# EAGLE schematic Transimpedance_Amp_SchnitzerLab (EAGLE 6.4)
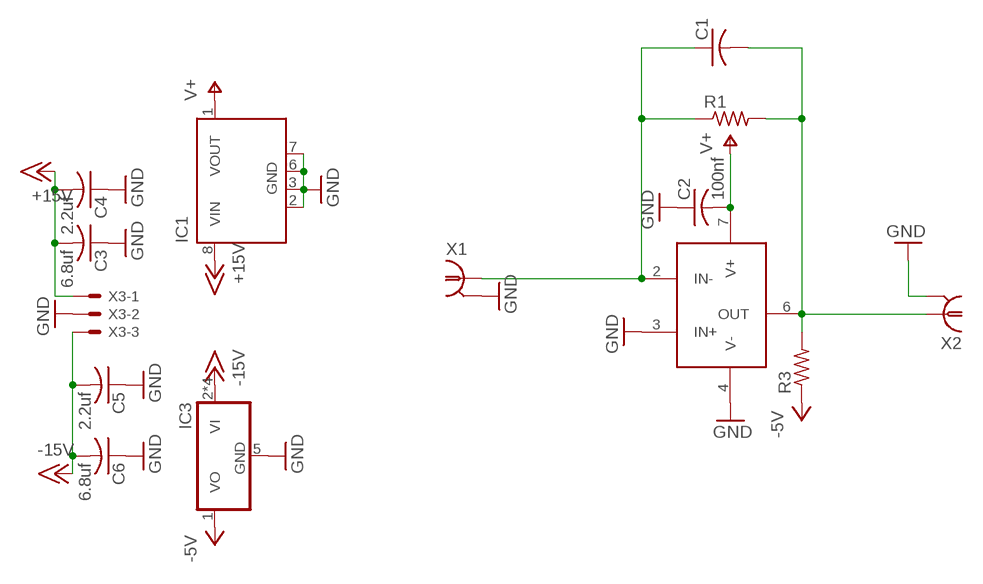
[diagram p0: schematic, sheet 1]

## Parts
C1  C-USC1206  [C1206]
C2  100nf  C-USC0504  [C0504]
C3  6.8uf  C-USC1206  [C1206]
C4  2.2uf  C-USC1206  [C1206]
C5  2.2uf  C-USC1206  [C1206]
C6  6.8uf  C-USC1206  [C1206]
IC1  78L05SMD  [SO08]
IC2  OPA380AIDG4  [SOIC8]
IC3  79LSMD  [SOIC8]
R1  R-US_M1206  [M1206]
R3  R-US_M1206  [M1206]
X1  1-227161-6  [AMP_227161]
X2  1-227161-6  [AMP_227161]
X3  22-23-2031  [22-23-2031]

## Nets
+15V: C3.2 C4.2 IC1.8(VIN) X3.1
-5V: IC3.1(VO) R3.1
-15V: C5.2 C6.2 IC3.2(VI) IC3.3(VI) IC3.6(VI) IC3.7(VI) X3.3
GND: C2.1 C3.1 C4.1 C5.1 C6.1 IC1.2(GND) IC1.6(GND) IC1.7(GND) IC2.3(IN+) IC2.4(V-) IC3.5(GND) X1.2 X2.2 X3.2
N$1: C1.1 IC2.2(IN-) R1.1 X1.1
N$2: C1.2 IC2.6(OUT) R1.2 R3.2 X2.1
V+: C2.2 IC1.1(VOUT) IC2.7(V+)
Unconnected: IC1.4(NC) IC1.5(NC)

## Power pins joined to a net without a drawn wire
GND: IC1.3(GND)

## Library data of the parts
C1-C6 = rcl:C-US: CAPACITOR, American symbol
IC1 = linear:78L*SMD: Positive VOLTAGE REGULATOR
IC2 = Custom:OPA380AIDG4
IC3 = linear:79L*SMD
R1 R3 = rcl:R-US_: RESISTOR, American symbol
X1 X2 = con-coax:?227161*: JACK, RIGHT ANGLE, 50 OHM, PCB, BNC Source: amp_227161.pdf; MF: TYCO ELECTRONICS; MPN: 1-227161-6; OC_FARNELL: unknown; OC_NEWARK: 09H7854
X3 = con-molex:22-23-2031: .100" (2.54mm) Center Header - 3 Pin; MF: MOLEX; MPN: 22-23-2031; OC_FARNELL: 1462950; OC_NEWARK: 30C0862